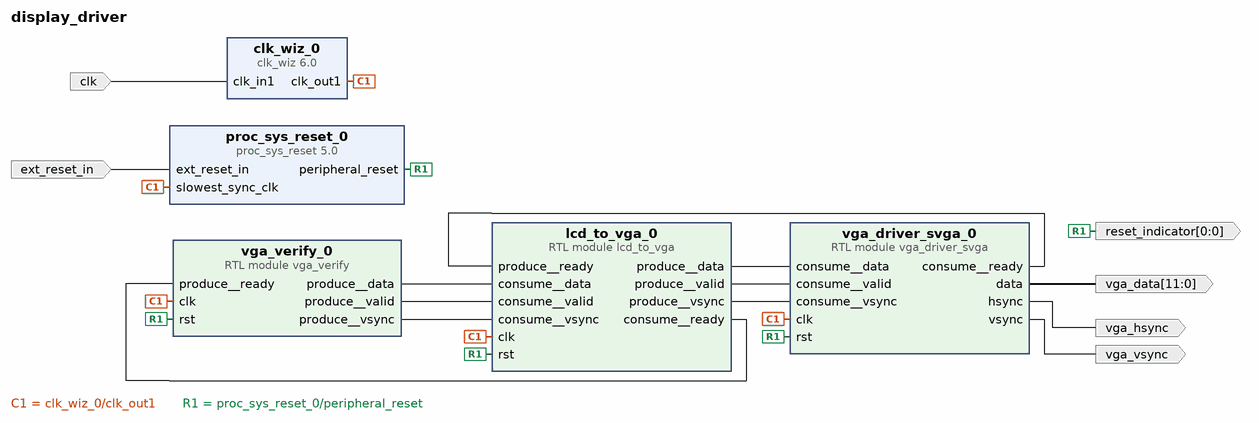
[diagram p0: block diagram of the top level]
# Vivado block design display_driver, xc7a35tcpg236-1, Vivado 2024.1
create_bd_design display_driver

create_bd_port -dir O -from 11 -to 0 vga_data
create_bd_port -dir O vga_hsync
create_bd_port -dir O vga_vsync
create_bd_port -dir I -type clk clk
set_property -dict {CONFIG.FREQ_HZ 100000000} [get_bd_ports clk]
create_bd_port -dir I -type rst ext_reset_in
create_bd_port -dir O -from 0 -to 0 -type rst reset_indicator

create_bd_cell -type module -reference vga_verify vga_verify_0
create_bd_cell -type module -reference vga_driver_svga vga_driver_svga_0
create_bd_cell -type ip -vlnv xilinx.com:ip:clk_wiz:6.0 clk_wiz_0
set_property -dict [list \
  CONFIG.CLKOUT1_JITTER 234.636 \
  CONFIG.CLKOUT1_PHASE_ERROR 298.923 \
  CONFIG.CLKOUT1_REQUESTED_OUT_FREQ 120.000 \
  CONFIG.MMCM_CLKFBOUT_MULT_F 50.250 \
  CONFIG.MMCM_CLKOUT0_DIVIDE_F 8.375 \
  CONFIG.MMCM_DIVCLK_DIVIDE 5 \
  CONFIG.USE_LOCKED false \
  CONFIG.USE_RESET false \
] [get_bd_cells clk_wiz_0]
create_bd_cell -type ip -vlnv xilinx.com:ip:proc_sys_reset:5.0 proc_sys_reset_0
create_bd_cell -type module -reference lcd_to_vga lcd_to_vga_0

# ---- connections ----

connect_bd_net [get_bd_ports clk] [get_bd_pins clk_wiz_0/clk_in1]
connect_bd_net [get_bd_pins clk_wiz_0/clk_out1] \
  [get_bd_pins proc_sys_reset_0/slowest_sync_clk] [get_bd_pins vga_driver_svga_0/clk] [get_bd_pins vga_verify_0/clk] \
  [get_bd_pins lcd_to_vga_0/clk]
connect_bd_net [get_bd_ports ext_reset_in] [get_bd_pins proc_sys_reset_0/ext_reset_in]
connect_bd_net [get_bd_pins lcd_to_vga_0/consume__ready] [get_bd_pins vga_verify_0/produce__ready]
connect_bd_net [get_bd_pins lcd_to_vga_0/produce__data] [get_bd_pins vga_driver_svga_0/consume__data]
connect_bd_net [get_bd_pins lcd_to_vga_0/produce__valid] [get_bd_pins vga_driver_svga_0/consume__valid]
connect_bd_net [get_bd_pins lcd_to_vga_0/produce__vsync] [get_bd_pins vga_driver_svga_0/consume__vsync]
connect_bd_net [get_bd_pins proc_sys_reset_0/peripheral_reset] \
  [get_bd_ports reset_indicator] [get_bd_pins vga_driver_svga_0/rst] [get_bd_pins vga_verify_0/rst] \
  [get_bd_pins lcd_to_vga_0/rst]
connect_bd_net [get_bd_pins vga_driver_svga_0/consume__ready] [get_bd_pins lcd_to_vga_0/produce__ready]
connect_bd_net [get_bd_pins vga_driver_svga_0/data] [get_bd_ports vga_data]
connect_bd_net [get_bd_pins vga_driver_svga_0/hsync] [get_bd_ports vga_hsync]
connect_bd_net [get_bd_pins vga_driver_svga_0/vsync] [get_bd_ports vga_vsync]
connect_bd_net [get_bd_pins vga_verify_0/produce__data] [get_bd_pins lcd_to_vga_0/consume__data]
connect_bd_net [get_bd_pins vga_verify_0/produce__valid] [get_bd_pins lcd_to_vga_0/consume__valid]
connect_bd_net [get_bd_pins vga_verify_0/produce__vsync] [get_bd_pins lcd_to_vga_0/consume__vsync]

validate_bd_design
save_bd_design
